# Altium schematic sheet Capacitor.SchDoc: Capacitor
size A; DocumentNumber: 1; SheetNumber: 1; SheetTotal: 1
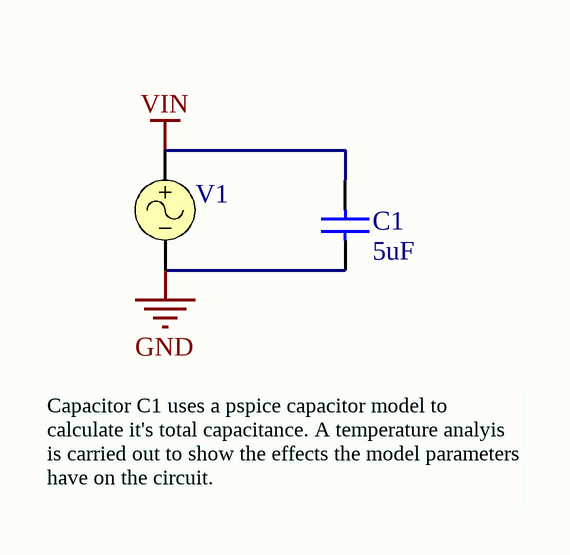
[diagram p0: Capacitor.SchDoc]

## Parts
C1  value 5uF  [RAD-0.3]  (hidden comment: Cap)
V1  VSIN  (value not drawn)

## Nets
GND: C1.2 V1.2
VIN: C1.1 V1.1

## Notes on the sheet
- Capacitor C1 uses a pspice capacitor model to calculate it's total capacitance. A temperature analyis is carried out to show the effects the model parameters have on the circuit.
- Title
- Size:
- Date:
- A
- Number:
- Time:
- Revision:
- Sheet
- of
- File:

## Library data of the parts
C1 = Cap: Capacitor; Published: 8-Jun-2000; LatestRevisionDate: 17-Jul-2002; LatestRevisionNote: Re-released for DXP Platform.; Publisher: Altium Limited
V1 = VSIN: Sinusoidal Voltage Source; Note: PCB Footprint - Not required; Published: 8-Jun-2000; LatestRevisionDate: 15-Nov-2004; LatestRevisionNote: Corrected Netlist.; PackageReference: Not Applicable; Publisher: Altium Limited